# Altium schematic sheet Sch_Mang_giao_thuc_Iot.SchDoc
size A; SheetNumber: 1; SheetTotal: 1
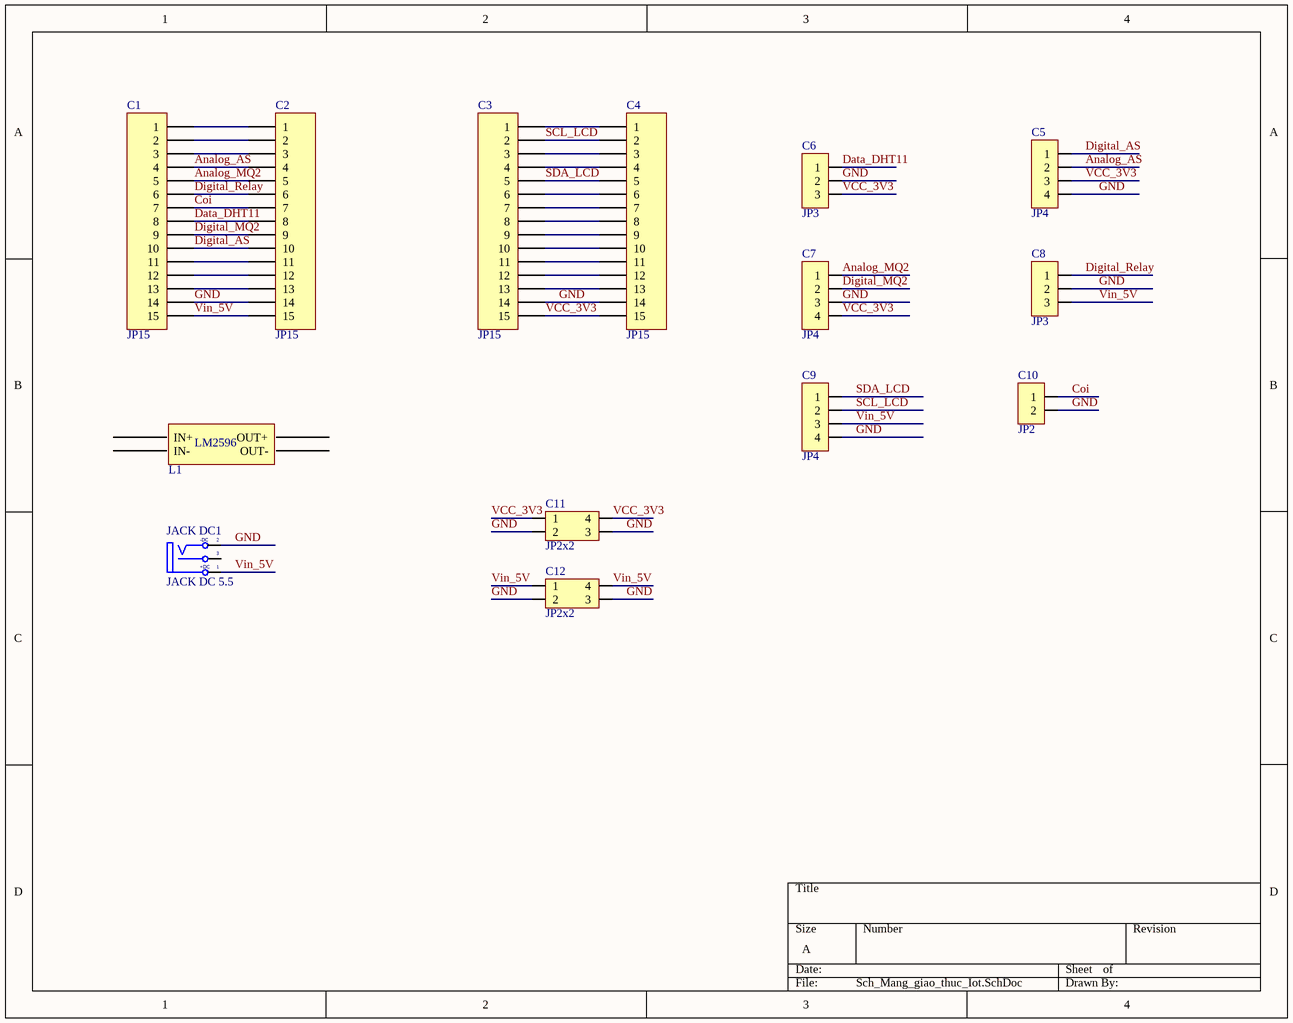
[diagram p0: Sch_Mang_giao_thuc_Iot.SchDoc]

## Parts
C1  JP15  [JP15-C1T]
C2  JP15  [JP15-C1T]
C3  JP15  [JP15-C1T]
C4  JP15  [JP15-C1T]
C5  JP4  [JP4-C1T]
C6  JP3  [JP3-C1T]
C7  JP4  [JP4-C1T]
C8  JP3  [JP3-C1T]
C9  JP4  [JP4-C1T]
C10  JP2  [JP2-C1T]
C11  JP2x2  [JP2-C2T]
C12  JP2x2  [JP2-C2T]
JACK_DC1  JACK DC 5.5  [JACK DC 5.5]
L1  BUCK_LM2596  [BUCK_LM2596]  (value not drawn)

## Nets
Analog_AS: C1.4 C2.4 C5.2
Analog_MQ2: C1.5 C2.5 C7.1
Coi: C1.7 C2.7 C10.1
Data_DHT11: C1.8 C2.8 C6.1
Digital_AS: C1.10 C2.10 C5.1
Digital_MQ2: C1.9 C2.9 C7.2
Digital_Relay: C1.6 C2.6 C8.1
GND: C1.14 C2.14 C3.14 C4.14 C5.4 C6.2 C7.3 C8.2 C9.4 C10.2 C11.2 C11.3 C12.2 C12.3 JACK_DC1.2(TN)
SCL_LCD: C3.2 C4.2 C9.2
SDA_LCD: C3.5 C4.5 C9.1
VCC_3V3: C3.15 C4.15 C5.3 C6.3 C7.4 C11.1 C11.4
Vin_5V: C1.15 C2.15 C8.3 C9.3 C12.1 C12.4 JACK_DC1.1(T)
NetC1_1: C1.1 C2.1
NetC1_2: C1.2 C2.2
NetC1_3: C1.3 C2.3
NetC1_11: C1.11 C2.11
NetC1_12: C1.12 C2.12
NetC1_13: C1.13 C2.13
NetC3_1: C3.1 C4.1
NetC3_3: C3.3 C4.3
NetC3_4: C3.4 C4.4
NetC3_6: C3.6 C4.6
NetC3_7: C3.7 C4.7
NetC3_8: C3.8 C4.8
NetC3_9: C3.9 C4.9
NetC3_10: C3.10 C4.10
NetC3_11: C3.11 C4.11
NetC3_12: C3.12 C4.12
NetC3_13: C3.13 C4.13

Not connected (* = marked no-connect by the designer): JACK_DC1 3(S); L1 1(IN+) 2(IN-) 3(OUT-) 4(OUT+)

## Notes on the sheet
- (in symbol BUCK_LM2596) LM2596
- (in symbol JACK DC 5.5) -DC; +DC

## Library data of the parts
C1-C4 = JP15: WR-PHD 2.54 mm Angled Socket Header; Manufacturer: W¨¹rth Elektronik eiSos GmbH; partNo: 613015143121; ComponentLink1 Description: Manufacturer; ComponentLink2 Description: Datasheet; NoPins: 15; Created Date: 29 March 2013; ComponentLink1URL: http://www.we-online.com; ComponentLink2URL: http://katalog.we-online.de/em/datasheet/6130xx143121.pdf; Created by: Karrer Zheng
C5 C7 C9 = JP4: WR-PHD 2.54 mm Angled Socket Header; Manufacturer: W¨¹rth Elektronik eiSos GmbH; partNo: 613004143121; ComponentLink1 Description: Manufacturer; ComponentLink2 Description: Datasheet; NoPins: 04; Created Date: 29 March 2013; ComponentLink1URL: http://www.we-online.com; ComponentLink2URL: http://katalog.we-online.de/em/datasheet/6130xx143121.pdf; Created by: Karrer Zheng
C6 C8 = JP3: WR-PHD 2.54 mm Angled Socket Header; Manufacturer: W¨¹rth Elektronik eiSos GmbH; partNo: 613003143121; ComponentLink1 Description: Manufacturer; ComponentLink2 Description: Datasheet; NoPins: 03; Created Date: 29 March 2013; ComponentLink1URL: http://www.we-online.com; ComponentLink2URL: http://katalog.we-online.de/em/datasheet/6130xx143121.pdf; Created by: Karrer Zheng
C10 = JP2: WR-PHD 2.54 mm Angled Socket Header; Manufacturer: W¨¹rth Elektronik eiSos GmbH; partNo: 613002143121; ComponentLink1 Description: Manufacturer; ComponentLink2 Description: Datasheet; NoPins: 02; Created Date: 29 March 2013; ComponentLink1URL: http://www.we-online.com; ComponentLink2URL: http://katalog.we-online.de/em/datasheet/6130xx143121.pdf; Created by: Karrer Zheng
C11 C12 = JP2x2: WR-PHD 2.54 mm Dual Socket Header; Manufacturer: W¨¹rth Elektronik eiSos GmbH; partNo: 61300421821; ComponentLink1 Description: Manufacturer; ComponentLink2 Description: Datasheet; NoPins: 04; Created Date: 29 March 2013; ComponentLink1URL: http://www.we-online.com; ComponentLink2URL: http://katalog.we-online.de/em/datasheet/6130xx21821.pdf; Created by: Karrer Zheng
JACK_DC1 = JACK DC 5.5: Value: Jac DC